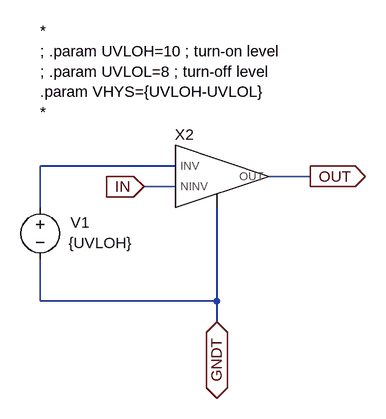
[diagram p0: schematic UVLO.asc]
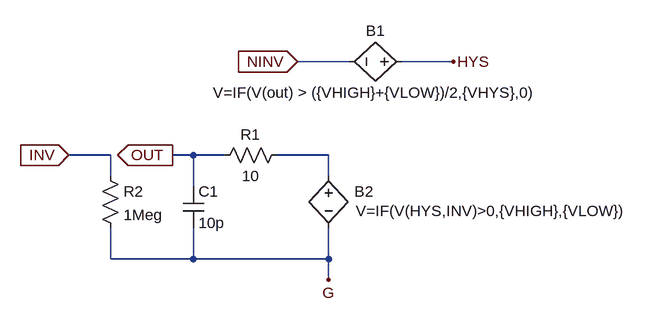
[diagram p1: sub-circuit comptof_g.asc]
UVLO.asc, the LTspice schematic file:
Version 4.1
SHEET 1 880 680
WIRE 64 288 -144 288
WIRE 272 304 208 304
WIRE 64 320 16 320
WIRE -144 352 -144 288
WIRE -144 496 -144 432
WIRE 128 496 128 352
WIRE 128 496 -144 496
WIRE 128 528 128 496
FLAG 16 320 IN
IOPIN 16 320 In
FLAG 272 304 OUT
IOPIN 272 304 Out
FLAG 128 528 GNDT
IOPIN 128 528 BiDir
SYMBOL voltage -144 336 R0
WINDOW 0 47 39 Left 2
WINDOW 3 44 71 Left 2
SYMATTR InstName V1
SYMATTR Value {UVLOH}
SYMBOL TOF\\Subcircuits\\COMPTOF_G 128 304 R0
WINDOW 0 -50 -49 Bottom 2
SYMATTR InstName X2
SYMATTR SpiceLine VHIGH=5 VLOW=100m VHYS=VHYS
TEXT -144 80 Left 2 !*\n; .param UVLOH=10 ; turn-on level\n; .param UVLOL=8 ; turn-off level\n.param VHYS={UVLOH-UVLOL}\n*

comptof_g.asc, the sub-circuit schematic file:
Version 4.1
SHEET 1 880 680
WIRE 64 192 -16 192
WIRE 224 192 144 192
WIRE -304 336 -368 336
WIRE -176 336 -208 336
WIRE -128 336 -176 336
WIRE 32 336 -48 336
WIRE -304 368 -304 336
WIRE 32 368 32 336
WIRE -176 384 -176 336
WIRE -304 496 -304 448
WIRE -176 496 -176 448
WIRE -176 496 -304 496
WIRE 32 496 32 448
WIRE 32 496 -176 496
WIRE 32 528 32 496
FLAG -16 192 NINV
IOPIN -16 192 In
FLAG 224 192 HYS
FLAG -208 336 OUT
IOPIN -208 336 Out
FLAG -368 336 INV
IOPIN -368 336 In
FLAG 32 528 G
SYMBOL bv 160 192 R90
WINDOW 0 -32 56 VBottom 2
WINDOW 3 32 56 VTop 2
SYMATTR InstName B1
SYMATTR Value V=IF(V(out) > ({VHIGH}+{VLOW})/2,{VHYS},0)
SYMBOL bv 32 352 R0
WINDOW 0 40 40 Left 2
WINDOW 3 42 70 Left 2
SYMATTR InstName B2
SYMATTR Value V=IF(V(HYS,INV)>0,{VHIGH},{VLOW})
SYMBOL res -32 320 R90
WINDOW 0 0 56 VBottom 2
WINDOW 3 32 56 VTop 2
SYMATTR InstName R1
SYMATTR Value 10
SYMBOL cap -192 384 R0
SYMATTR InstName C1
SYMATTR Value 10p
SYMBOL res -320 352 R0
SYMATTR InstName R2
SYMATTR Value 1Meg

The netlist it stands for:
* UVLO.asc
V1 N001 GNDT {UVLOH}
X§X2 N001 IN OUT GNDT comptof_g params: VHIGH=5 VLOW=100m VHYS=VHYS

* block symbol definitions
.subckt comptof_g INV NINV OUT G
B1 HYS NINV V=IF(V(out) > ({VHIGH}+{VLOW})/2,{VHYS},0)
B2 N001 G V=IF(V(HYS,INV)>0,{VHIGH},{VLOW})
R1 N001 OUT 10
C1 OUT G 10p
R2 INV G 1Meg
.ends comptof_g

*
; .param UVLOH=10 ; turn-on level
; .param UVLOL=8 ; turn-off level
.param VHYS={UVLOH-UVLOL}
*
.backanno
.end